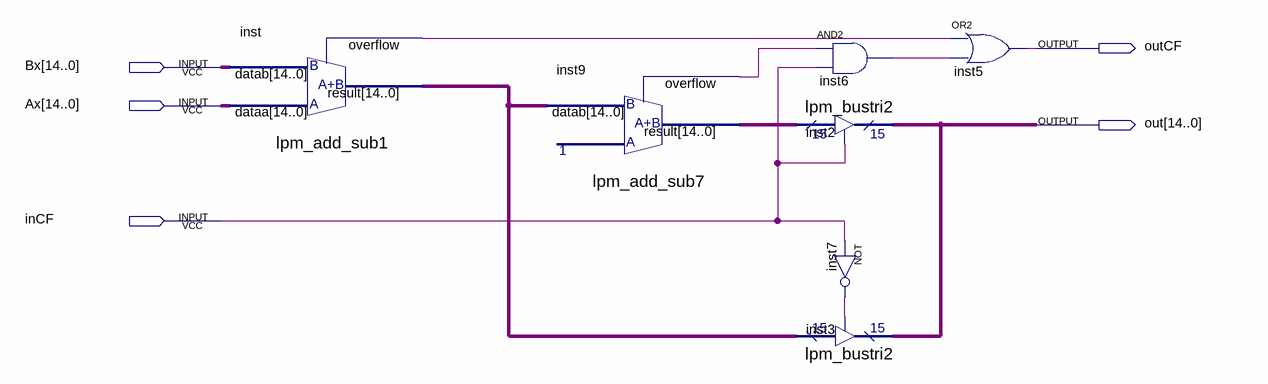
[diagram p0: schematic sheet]
// Quartus schematic ALU_ADDC.bdf as structural Verilog: 7 symbols, 5 pins
module ALU_ADDC (
  input  [14:0] Bx,
  input  [14:0] Ax,
  input  inCF,
  output outCF,
  output [14:0] out
);

  wire inst6_out, inst7_out, inst9_overflow, inst_overflow;
  wire [14:0] inst9_result, inst_result;

  lpm_add_sub1 inst (.dataa(Ax), .datab(Bx), .result(inst_result), .overflow(inst_overflow));
  lpm_add_sub7 inst9 (.datab(inst_result), .result(inst9_result), .overflow(inst9_overflow));
  lpm_bustri2 inst2 (.enabledt(inCF), .data(inst9_result), .tridata(out));
  lpm_bustri2 inst3 (.enabledt(inst7_out), .data(inst_result), .tridata(out));
  and inst6 (inst6_out, inst9_overflow, inCF);
  not inst7 (inst7_out, inCF);
  or inst5 (outCF, inst_overflow, inst6_out);
endmodule
